# Altium project STM32_TRACKER.PrjPcb
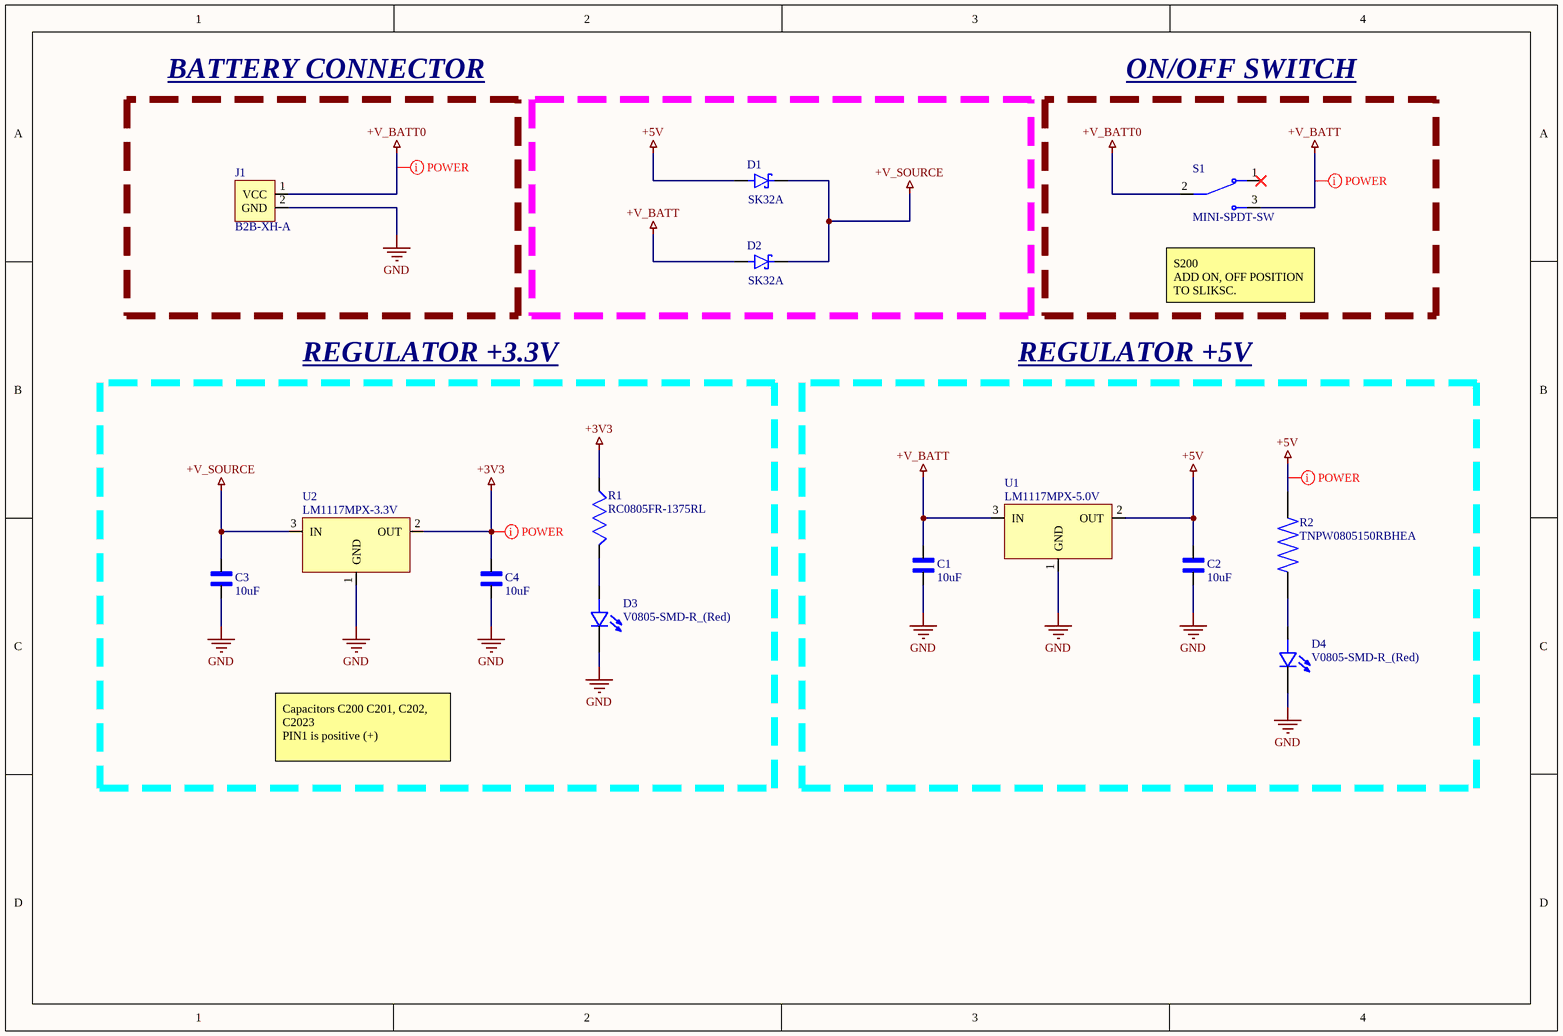
[diagram p0: Supply Power.SchDoc]
4 sheets, 43 parts. Net scope: global (net labels, ports and power ports of the same name join across sheets).
Board file: STM32_Tracker.PcbDoc
Sheets:
  Supply Power.SchDoc
  Interface.SchDoc
  STM32_MCU.SchDoc
  MPU-GPS.SchDoc

## Sheet Supply Power.SchDoc
size A4; SheetNumber: 1; SheetTotal: 4

### Parts
C1  value 10uF  [CAPPC7343X430N]  (hidden comment: T495D106K035AHE300)
C2  value 10uF  [CAPPC7343X430N]  (hidden comment: T495D106K035AHE300)
C3  value 10uF  [CAPPC7343X430N]  (hidden comment: T495D106K035AHE300)
C4  value 10uF  [CAPPC7343X430N]  (hidden comment: T495D106K035AHE300)
D1  SK32A  [DIOM4325X250N]
D2  SK32A  [DIOM4325X250N]
D3  V0805-SMD-R_(Red)  [LED_V0805-SMD-R (Red)]
D4  V0805-SMD-R_(Red)  [LED_V0805-SMD-R (Red)]
J1  B2B-XH-A  [B2B-XH-A]
R1  RC0805FR-1375RL  [RESC2012X60N]
R2  TNPW0805150RBHEA  [RESC2012X55N]
S1  MINI-SPDT-SW  [SW_MINI-SPDT-SW]
U1  LM1117MPX-5.0V  [SOT230P700X180-4N]
U2  LM1117MPX-3.3V  [SOT230P700X180-4N]

### Blocks framed on the sheet
BATTERY CONNECTOR: J1
ON/OFF SWITCH: S1
REGULATOR +3.3V: C3 C4 D3 R1 U2
REGULATOR +5V: C1 C2 D4 R2 U1

### Nets
+3V3: C4.1 R1.2 U2.2(OUT)
+5V: C2.1 D1.A R2.2 U1.2(OUT)
+V_BATT: C1.1 D2.A S1.3 U1.3(IN)
+V_BATT0: J1.1(VCC) S1.2
+V_SOURCE: C3.1 D1.C(K) D2.C(K) U2.3(IN)
GND: C1.2 C2.2 C3.2 C4.2 D3.1(C) D4.1(C) J1.2(GND) U1.1(GND) U2.1(GND)
NetD3_2: D3.2(A) R1.1
NetD4_2: D4.2(A) R2.1

Not connected (* = marked no-connect by the designer): S1 1*

### Layout directives
net class POWER_Nets: +3V3, +5V, +V_BATT, +V_BATT0

### Notes on the sheet
- (near S1) S200
  ADD ON, OFF POSITION TO SLIKSC.
- Capacitors C200 C201, C202, C2023
  PIN1 is positive (+)

### Library data of the parts
C1-C4 = T495D106K035AHE300: Capacitor,10uF,35VDC,10-% Tol,10+% Tol; MF: {'manufacturer': u'KEMET'}; Package: None; Price: None; MP: T495D106K035AHE300; Availability: Unavailable
D1 D2 = SK32A: MF: {'manufacturer': u'Taiwan Semiconductor'}; Package: None; Price: None; Value: *; MP: SK32A; Availability: Unavailable
D3 D4 = V0805-SMD-R_(Red): V0805 - Valcon 0805 Type Surface Mount LED; MF: {'manufacturer': u'Valcon'}; Package: None; Price: None; Value: *; MP: V0805-SMD-R_(Red); Availability: Unavailable
J1 = B2B-XH-A-2Pin
R1 = RC0805FR-1375RL: MF: {'manufacturer': u'Yageo'}; Package: None; Price: None; Value: *; MP: RC0805FR-1375RL; Availability: Unavailable
R2 = TNPW0805150RBHEA: MF: {'manufacturer': u'Vishay'}; Package: None; Price: None; Value: *; MP: TNPW0805150RBHEA; Availability: Unavailable
S1 = MINI-SPDT-SW: Simple breadboard friendly SPDT slide switch. Rated at 30V/200mA with operating force of 250 +/-100gf.; MF: {'manufacturer': u'Gravitech'}; Package: None; Price: None; Value: *; MP: MINI-SPDT-SW; Availability: Unavailable
U1 = LM1117MPX-5.0V: LM1117MPX-50NOPB; Vout: 5V
U2 = LM1117MPX-3.3V: LM1117MPX-33NOPB; Vout: 5V

## Sheet Interface.SchDoc
size A; SheetNumber: 2; SheetTotal: 4
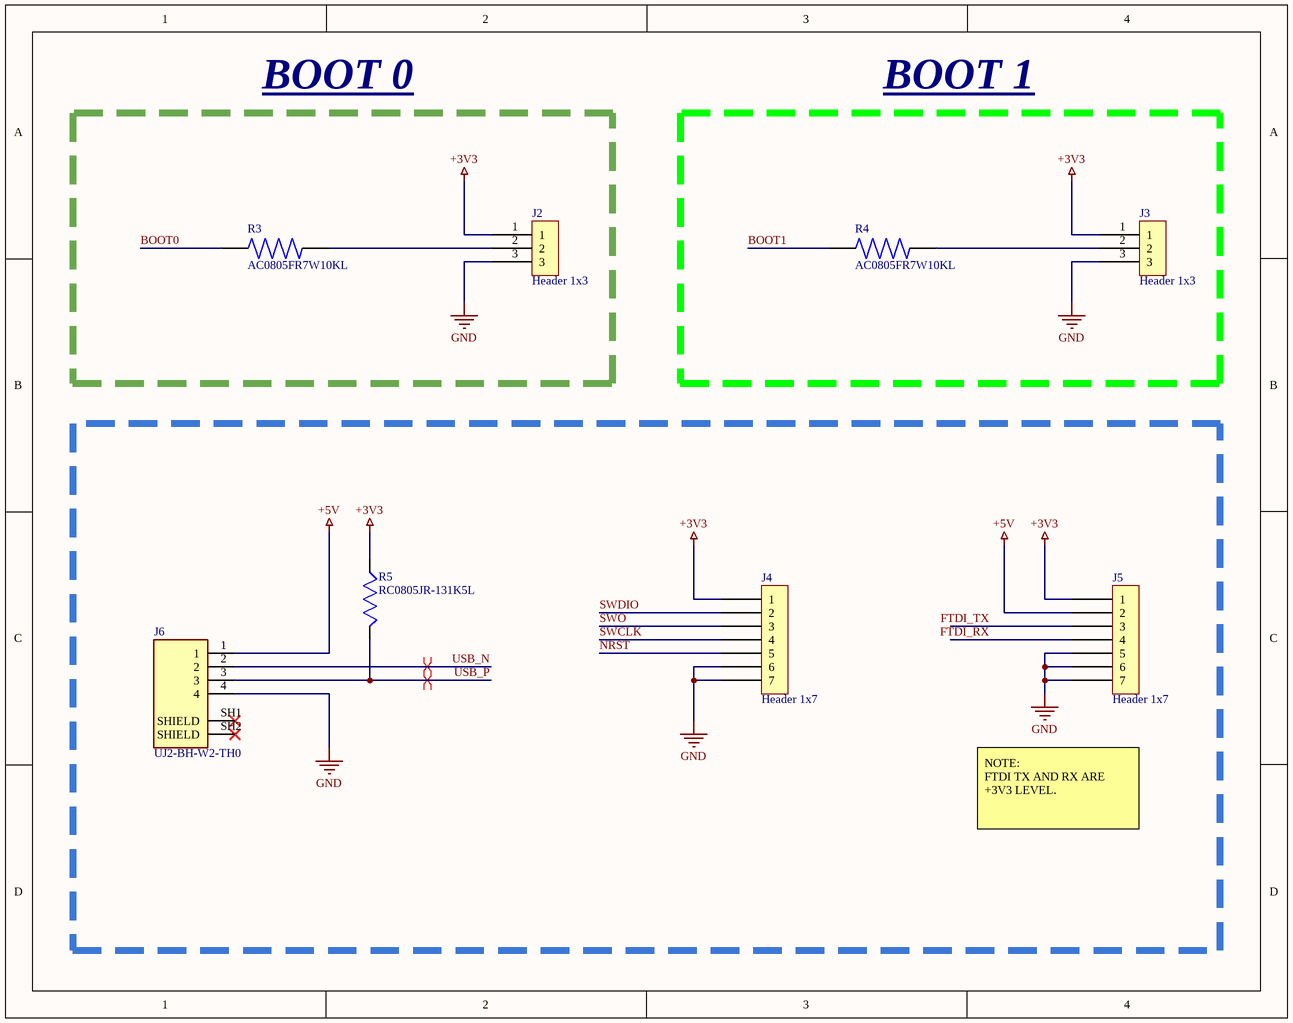
[diagram p1: Interface.SchDoc]

### Parts
J2  Header 1x3  [Header 1x3 male]
J3  Header 1x3  [Header 1x3 male]
J4  Header 1x7  [Header 1x7 male]
J5  Header 1x7  [Header 1x7 male]
J6  UJ2-BH-W2-TH0  [UJ2-BH-W2-TH0]
R3  AC0805FR7W10KL  [RESC2012X60N]
R4  AC0805FR7W10KL  [RESC2012X60N]
R5  RC0805JR-131K5L  [RESC2012X60N]

### Blocks framed on the sheet
BOOT 0: J2 R3
BOOT 1: J3 R4

### Nets
+3V3: J2.1 J3.1 J4.1 J5.1 R5.2
+5V: J5.2 J6.1
GND: J2.3 J3.3 J4.6 J4.7 J5.5 J5.6 J5.7 J6.4
BOOT0: R3.1
BOOT1: R4.1
FTDI_RX: J5.4
FTDI_TX: J5.3
NRST: J4.5
SWCLK: J4.4
SWDIO: J4.2
SWO: J4.3
USB_N: J6.2
USB_P: J6.3 R5.1
NetJ2_2: J2.2 R3.2
NetJ3_2: J3.2 R4.2

Not connected (* = marked no-connect by the designer): J6 SH1(SHIELD)* SH2(SHIELD)*

### Layout directives
differential pair; differential pair class USB: USB_N, USB_P

### Notes on the sheet
- NOTE:
  FTDI TX AND RX ARE +3V3 LEVEL.

### Library data of the parts
J6 = UJ2-BH-W2-TH0: 6 Âµin Plating Thickness, White Insulator, USB Receptacle; MF: {'manufacturer': u'CUI Devices'}; Package: None; Price: None; Value: *; MP: UJ2-BH-W2-TH; Availability: Unavailable
R3 R4 = AC0805FR7W10KL: RES SMD 18 OHM 5% 1/8W 0805; MF: {'manufacturer': u'Yageo Corporation'}; Package: None; Price: None; Value: *; MP: AC0805FR7W10KL; Availability: Unavailable
R5 = RC0805JR-131K5L: MF: {'manufacturer': u'Yageo'}; Package: None; Price: None; Value: *; MP: RC0805JR-131K5L; Availability: Unavailable

## Sheet STM32_MCU.SchDoc
size A4; SheetNumber: 3; SheetTotal: 4
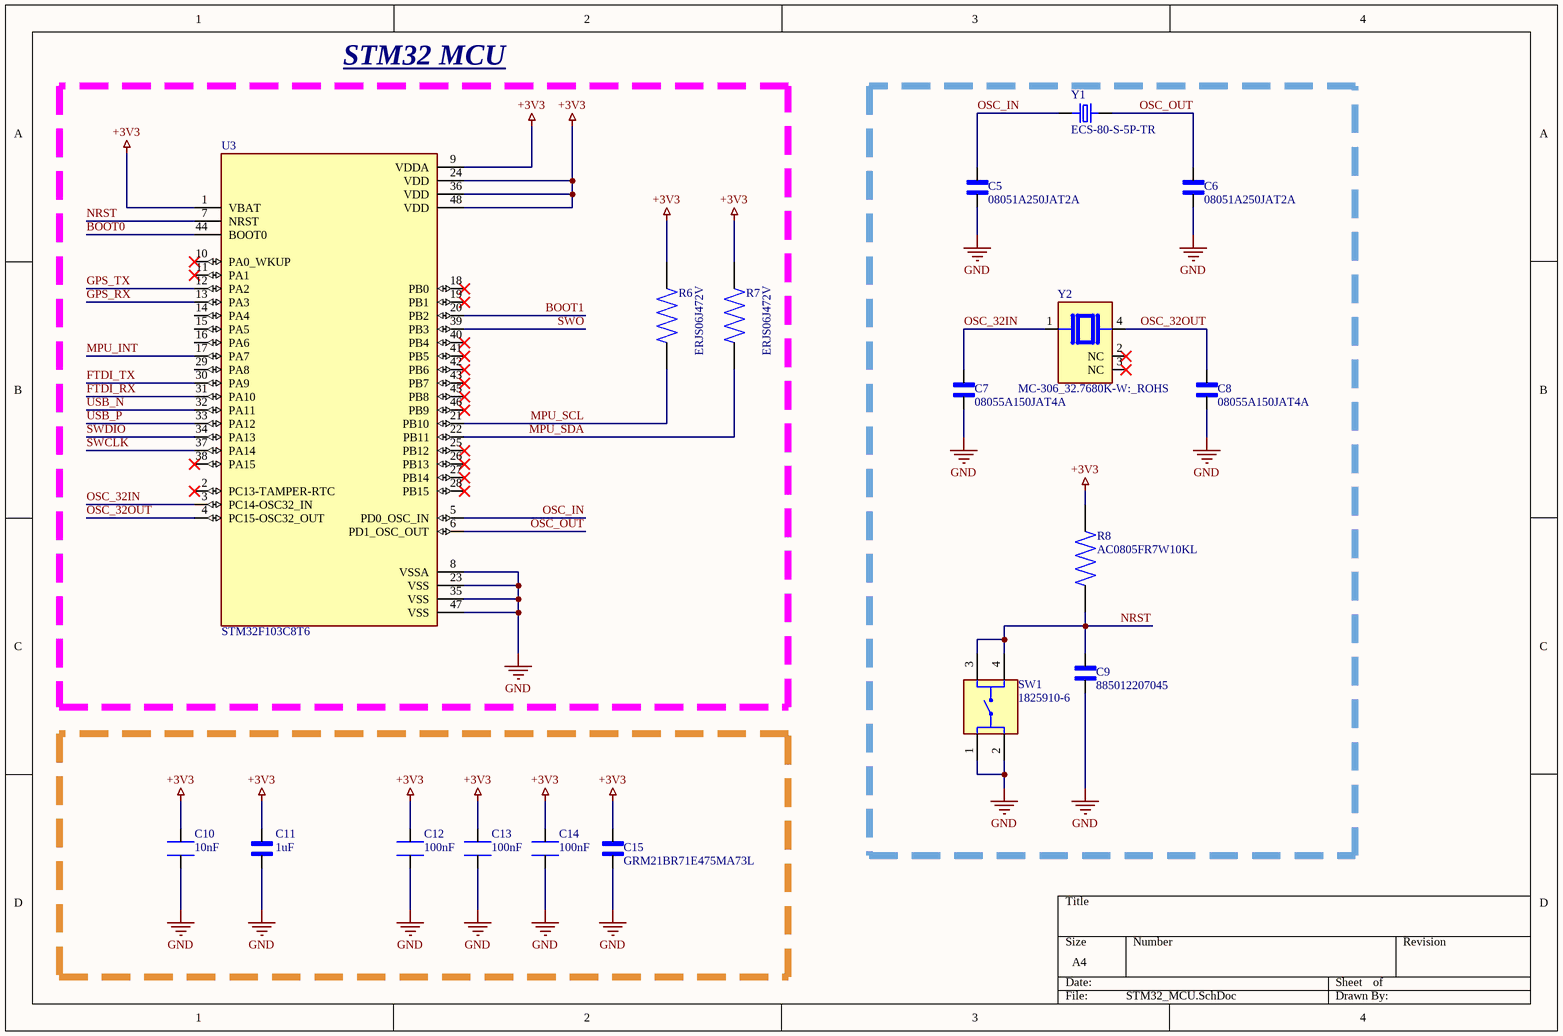
[diagram p2: STM32_MCU.SchDoc]

### Parts
C5  08051A250JAT2A  [CAPC2012X94N]
C6  08051A250JAT2A  [CAPC2012X94N]
C7  08055A150JAT4A  [CAPC2012X140N]
C8  08055A150JAT4A  [CAPC2012X140N]
C9  885012207045  [WCAP-CSGP_885012207045]
C10  value 10nF  [WCAP-CSST_885382207009]  (hidden comment: 885382207009)
C11  value 1uF  [CAPC2012X135N]  (hidden comment: GRM21BR71H105KA12L)
C12  value 100nF  [WCAP-CSST_885382207007]  (hidden comment: 885382207007)
C13  value 100nF  [WCAP-CSST_885382207007]  (hidden comment: 885382207007)
C14  value 100nF  [WCAP-CSST_885382207007]  (hidden comment: 885382207007)
C15  GRM21BR71E475MA73L  [CAPC2012X135N]
R6  ERJS06J472V  [RES_ERJS06J472V]
R7  ERJS06J472V  [RES_ERJS06J472V]
R8  AC0805FR7W10KL  [RESC2012X60N]
SW1  1825910-6  [SW_1825910-6-4]
U3  STM32F103C8T6  [QFP50P900X900X160-48N]
Y1  ECS-80-S-5P-TR  [XTAL_ECS-80-S-5P-TR]
Y2  MC-306_32.7680K-W:_ROHS  [XTAL_MC-306_32.7680K-W:_ROHS]

### Blocks framed on the sheet
STM32 MCU: R6 R7 U3

### Nets
+3V3: C10.2 C11.1 C12.2 C13.2 C14.2 C15.1 R6.2 R7.2 R8.2 U3.1(VBAT) U3.9(VDDA) U3.24(VDD) U3.36(VDD) U3.48(VDD)
GND: C5.1 C6.1 C7.2 C8.2 C9.1 C10.1 C11.2 C12.1 C13.1 C14.1 C15.2 SW1.1 SW1.2 U3.8(VSSA) U3.23(VSS) U3.35(VSS) U3.47(VSS)
BOOT0: U3.44(BOOT0)
BOOT1: U3.20(PB2)
FTDI_RX: U3.31(PA10)
FTDI_TX: U3.30(PA9)
GPS_RX: U3.13(PA3)
GPS_TX: U3.12(PA2)
MPU_INT: U3.17(PA7)
MPU_SCL: R6.1 U3.21(PB10)
MPU_SDA: R7.1 U3.22(PB11)
NRST: C9.2 R8.1 SW1.3 SW1.4 U3.7(NRST)
OSC_32IN: C7.1 U3.3(PC14-OSC32_IN) Y2.1
OSC_32OUT: C8.1 U3.4(PC15-OSC32_OUT) Y2.4
OSC_IN: C5.2 U3.5(PD0_OSC_IN) Y1.1
OSC_OUT: C6.2 U3.6(PD1_OSC_OUT) Y1.2
SWCLK: U3.37(PA14)
SWDIO: U3.34(PA13)
SWO: U3.39(PB3)
USB_N: U3.32(PA11)
USB_P: U3.33(PA12)

Not connected (* = marked no-connect by the designer): U3 2(PC13-TAMPER-RTC)* 10(PA0_WKUP)* 11(PA1)* 14(PA4) 15(PA5) 16(PA6) 18(PB0)* 19(PB1)* 25(PB12)* 26(PB13)* 27(PB14)* 28(PB15)* 29(PA8) 38(PA15)* 40(PB4)* 41(PB5)* 42(PB6)* 43(PB7)* 45(PB8)* 46(PB9)*; Y2 2(NC)* 3(NC)*

### Library data of the parts
C5 C6 = 08051A250JAT2A: Ceramic Multilayer Capacitor; Capacitor Type:General Purpose; Capacitance:25pF; Capacitance Tolerance:Â± 5%; Voltage Rating:100VDC; Capacitor Dielectric Type:Multilayer Ceramic; Package/Case:0805; Termination Type:SMD ;RoHS Compliant: Yes; MF: {'manufacturer': u'AVX'}; Package: None; Price: None; Value: *; MP: 08051A250JAT2A; Availability: Unavailable
C7 C8 = 08055A150JAT4A: Cap Ceramic 15pF 50V C0G 5% SMD 0805 125Â°C Paper T/R; MF: {'manufacturer': u'AVX'}; Package: None; Price: None; Value: *; MP: 08055A150JAT4A; Availability: Unavailable
C9 = 885012207045: <b> WCAP-CSGP Ceramic Capacitors <br> <br> <br><b>Characteristics </b><br> </b><br>Multilayer Ceramic Chip Capacitor <br>Recommended soldering:Reflow, for 0603 and 0805 wave soldering is also allowed <br>Operating temperature:-55 Â°C to +125 Â°C; <br>Ceramic characteristics: Class I - NPO ; Class II -X7R, X5R <br>High performance ceramic <br>High capacitance stability <br>Minimal aging  <br>Termination:Cu/Ni/Sn <br>   <br><a href="http://katalog.we-online.de/media/images/eisos/WCAP-CSGP_pf2.jpg" title="Enlarge picture"> <img src="http://katalog.we-online.de/media/thumbs2/eisos/thb_WCAP-CSGP_pf2.jpg" width="320"></a><p> Details see: <a href="http://katalog.we-online.de/en/pbs/WCAP-CSGP-0805?">http://katalog.we-online.de/en/pbs/WCAP-CSGP-0805? </a><p>Created:  2015-01-28 <br>2015 (C) Wurth Elektronik; MF: {'manufacturer': u'Wurth Electronics Inc'}; Package: None; Price: None; Value: *; MP: 885012207045; Availability: Unavailable
C10 = 885382207009: <b> WCAP-CSST Soft Termination MLCC <br> <br> <br><b>Characteristics </b><br> </b><br>Multilayer ceramic chip capacitors <br>Recommended soldering: Reflow <br>Operating temperature: -55 Â°C up to +125 Â°C <br>Capacitance range: 220 pF - 2.2 ÂµF <br>Rated voltage: 16 V(DC) up to 2 kV(DC) <br>Size: 0603, 0805, 1206 and 1210 <br>High absorbtion of mechanical stress   <br> <br> <br><b>Applications </b><br> <br>Application with high mechanical stress <br>Power supply <br>Lighting  <br> <br> <br><a href="https://katalog.we-online.de/media/images/v2/Family_WCAP-CSST.jpg" title="Enlarge picture"> <img src="https://katalog.we-online.de/media/images/v2/Family_WCAP-CSST.jpg" width="320"></a><p> Details see: <a href="https://katalog.we-online.de/en/pbs/WCAP-CSST#vs_ct:1">https://katalog.we-online.de/en/pbs/WCAP-CSST#vs_ct:1<br> <br></a><p>Created By Yingchun,Shan 2018-11-14 <br><br>20178(C) Wurth Elektronik; MF: {'manufacturer': u'Wurth Electronics Inc'}; Package: None; Price: None; MP: 885382207009; Availability: Unavailable
C11 = GRM21BR71H105KA12L: Cap Ceramic 1uF 50V X7R 10% SMD 0805 125Ã‚Â°C Embossed T/R; MF: {'manufacturer': u'Murata'}; Package: None; Price: None; MP: GRM21BR71H105KA12L; Availability: Unavailable
C12-C14 = 885382207007: <b> WCAP-CSST Soft Termination MLCC <br> <br> <br><b>Characteristics </b><br> </b><br>Multilayer ceramic chip capacitors <br>Recommended soldering: Reflow <br>Operating temperature: -55 Â°C up to +125 Â°C <br>Capacitance range: 220 pF - 2.2 ÂµF <br>Rated voltage: 16 V(DC) up to 2 kV(DC) <br>Size: 0603, 0805, 1206 and 1210 <br>High absorbtion of mechanical stress   <br> <br> <br><b>Applications </b><br> <br>Application with high mechanical stress <br>Power supply <br>Lighting  <br> <br> <br><a href="https://katalog.we-online.de/media/images/v2/Family_WCAP-CSST.jpg" title="Enlarge picture"> <img src="https://katalog.we-online.de/media/images/v2/Family_WCAP-CSST.jpg" width="320"></a><p> Details see: <a href="https://katalog.we-online.de/en/pbs/WCAP-CSST#vs_ct:1">https://katalog.we-online.de/en/pbs/WCAP-CSST#vs_ct:1<br> <br></a><p>Created By Yingchun,Shan 2018-11-14 <br><br>20178(C) Wurth Elektronik; MF: {'manufacturer': u'Wurth Electronics Inc'}; Package: None; Price: None; MP: 885382207007; Availability: Unavailable
C15 = GRM21BR71E475MA73L: CAP CER 4.7UF 25V X7R 0805; MF: {'manufacturer': u'Murata'}; Package: None; Price: None; Value: *; MP: GRM21BR71E475MA73L; Availability: Unavailable
R6 R7 = ERJS06J472V: MF: {'manufacturer': u'Panasonic'}; Package: None; Price: None; Value: *; MP: ERJS06J472V; Availability: Unavailable
R8 = AC0805FR7W10KL: as R3 on sheet Interface; Package: None; Price: None; Value: *; MP: AC0805FR7W10KL; Availability: Unavailable
SW1 = 1825910-6: Switch Tactile OFF (ON) SPST Round Button PC Pins 0.05A 24VDC 100000Cycles 1.57N Thru-Hole Loose; MF: {'manufacturer': u'TE Connectivity'}; Package: None; Price: None; Value: *; MP: 1825910-6; Availability: Unavailable
U3 = STM32F103C8T6: Mainstream Performance line, ARM Cortex-M3 MCU with 64 Kbytes Flash, 72 MHz CPU, motor control, USB and CAN; MF: {'manufacturer': u'STMicroelectronics'}; Package: None; Price: None; Value: *; MP: STM32F103C8T6; Availability: Unavailable
Y1 = ECS-80-S-5P-TR: CRYSTAL SMD; MF: {'manufacturer': u'ECS International'}; Package: None; Price: None; Value: *; MP: ECS-80-S-5P-TR; Availability: Unavailable
Y2 = MC-306_32.7680K-W:_ROHS: MF: {'manufacturer': u'EPSON'}; MP: MC-306 32.7680K-W: ROHS; Package: None; Price: None; Value: *; Availability: Unavailable

## Sheet MPU-GPS.SchDoc
size A; SheetNumber: 4; SheetTotal: 4
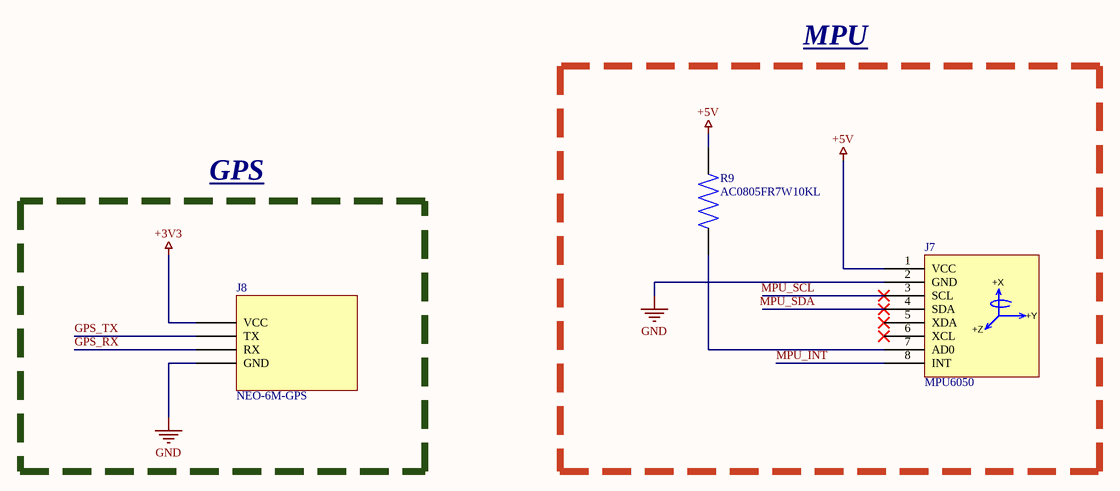
[diagram p3: MPU-GPS.SchDoc]

### Parts
J7  MPU6050  [MPU6050]
J8  NEO-6M-GPS  [NEO-6M-GPS]
R9  AC0805FR7W10KL  [RESC2012X60N]

### Blocks framed on the sheet
MPU: J7 R9
GPS: J8

### Nets
+3V3: J8.3(VCC)
+5V: J7.1(VCC) R9.1
GND: J7.2(GND) J8.0(GND)
GPS_RX: J8.2(RX)
GPS_TX: J8.1(TX)
MPU_INT: J7.8(INT)
MPU_SCL: J7.3(SCL)
MPU_SDA: J7.4(SDA)
NetJ7_7: J7.7(AD0) R9.2

Not connected (* = marked no-connect by the designer): J7 5(XDA)* 6(XCL)*

### Notes on the sheet
- (in symbol MPU6050) +X; +Y; +Z

### Library data of the parts
J8 = NEO-6M-GPS: Manufacturer: u-blox; Voltage - Supply: 2.7V ~ 3.6V; Modulation or Protocol: GPS; Data Interface: I2C
R9 = AC0805FR7W10KL: as R3 on sheet Interface; Package: None; Price: None; Value: *; MP: AC0805FR7W10KL; Availability: Unavailable

## Nets that join several sheets
+3V3: Supply Power (C4.1 R1.2 U2.2), Interface (5 pins), STM32_MCU (14 pins), MPU-GPS (J8.3)
+5V: Supply Power (C2.1 D1.A R2.2 U1.2), Interface (J5.2 J6.1), MPU-GPS (J7.1 R9.1)
GND: Supply Power (9 pins), Interface (8 pins), STM32_MCU (17 pins), MPU-GPS (J7.2 J8.0)
BOOT0: Interface (R3.1), STM32_MCU (U3.44)
BOOT1: Interface (R4.1), STM32_MCU (U3.20)
FTDI_RX: Interface (J5.4), STM32_MCU (U3.31)
FTDI_TX: Interface (J5.3), STM32_MCU (U3.30)
GPS_RX: STM32_MCU (U3.13), MPU-GPS (J8.2)
GPS_TX: STM32_MCU (U3.12), MPU-GPS (J8.1)
MPU_INT: STM32_MCU (U3.17), MPU-GPS (J7.8)
MPU_SCL: STM32_MCU (R6.1 U3.21), MPU-GPS (J7.3)
MPU_SDA: STM32_MCU (R7.1 U3.22), MPU-GPS (J7.4)
NRST: Interface (J4.5), STM32_MCU (5 pins)
SWCLK: Interface (J4.4), STM32_MCU (U3.37)
SWDIO: Interface (J4.2), STM32_MCU (U3.34)
SWO: Interface (J4.3), STM32_MCU (U3.39)
USB_N: Interface (J6.2), STM32_MCU (U3.32)
USB_P: Interface (J6.3 R5.1), STM32_MCU (U3.33)